# EAGLE schematic ESP32 EVSE (EAGLE 9.6.2)
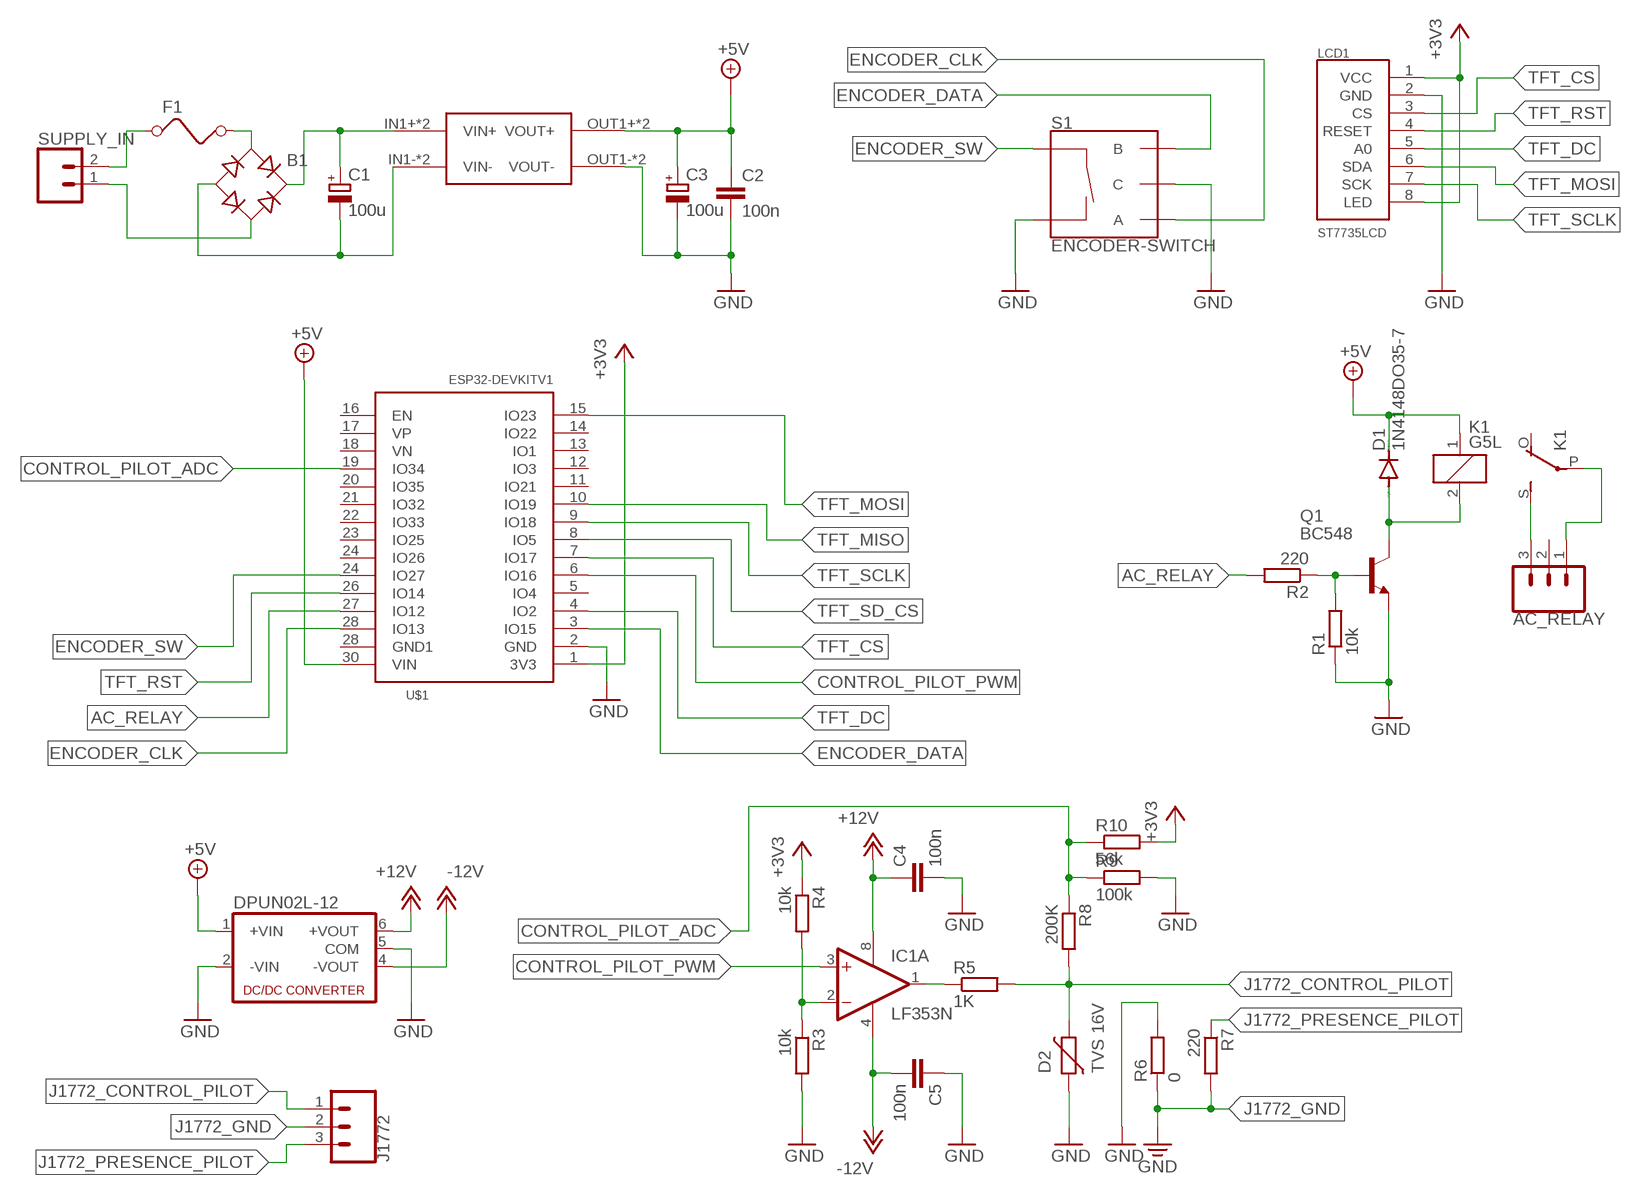
[diagram p0: schematic, sheet 1]

## Parts
AC_RELAY  CONN_03SCREW  [SCREWTERMINAL-3.5MM-3]
B1  B-DIL  [B-DIL]
C1  100u  CPOL-EUE2-5  [E2-5]
C2  100n  C-EU050-024X044  [C050-024X044]
C3  100u  CPOL-EUE2-5  [E2-5]
C4  100n  C-EU050-024X044  [C050-024X044]
C5  100n  C-EU050-024X044  [C050-024X044]
D1  1N4148DO35-7  [DO35-7]
D2  TVS 16V  TVS_DO-214AC(SMA)  [DIOM5226X290N]
DPUN02L-12  NMA  [NMA]
F1  FUSE  [FUSE]
IC1  LF353N  [DIL08]
J1772  CONN_03SCREW  [SCREWTERMINAL-3.5MM-3]
K1  G5L  [G5LE]
LCD1  ST7735LCD  [ST7735LCD]
Q1  BC548  [TO92-EBC]
R1  10k  R-EU_0204/5  [0204/5]
R2  220  R-EU_0204/5  [0204/5]
R3  10k  R-EU_0204/5  [0204/5]
R4  10k  R-EU_0204/5  [0204/5]
R5  1K  R-EU_0204/5  [0204/5]
R6  0  R-EU_0204/5  [0204/5]
R7  220  R-EU_0204/5  [0204/5]
R8  200K  R-EU_0204/5  [0204/5]
R9  100k  R-EU_0204/5  [0204/5]
R10  56k  R-EU_0204/5  [0204/5]
S1  ENCODER-SWITCH  [ROTARY_ENC_PLAIN]
SUPPLY_IN  CONN_023.5MM-NO_SILK  [SCREWTERMINAL-3.5MM-2-NS]
U$1  ESP32DEVKITV1  [ESP32-DEVKITV1]
U$2  MP1584  [DC-BRICK]

## Nets
+3V3: LCD1.1(VCC) LCD1.8(LED) R4.1 R10.2 U$1.1(3V3)
+5V: C2.1 C3.+ D1.C DPUN02L-12.1(+VIN) K1.1 U$1.30(VIN) U$2.OUT1+(VOUT+) U$2.OUT2+(VOUT+)
+12V: C4.1 DPUN02L-12.6(+VOUT) IC1.8(P:V+)
-12V: C5.2 DPUN02L-12.4(-VOUT) IC1.4(P:V-)
AC_RELAY: R2.2 U$1.27(IO12)
CONTROL_PILOT_ADC: R8.1 R9.1 R10.1 U$1.19(IO34)
CONTROL_PILOT_PWM: IC1.3(A:+IN) U$1.6(IO16)
ENCODER_CLK: S1.A U$1.28(IO13)
ENCODER_DATA: S1.B U$1.3(IO15)
ENCODER_SW: S1.SW+ U$1.24(IO27)
GND: C2.2 C3.- C4.2 C5.1 D2.1 DPUN02L-12.2(-VIN) DPUN02L-12.5(COM) LCD1.2(GND) Q1.E R1.1 R6.2 R9.2 S1.C S1.SW- U$1.2(GND) U$2.OUT1-(VOUT-) U$2.OUT2-(VOUT-)
J1772_CONTROL_PILOT: D2.2 J1772.1 R5.2 R8.2
J1772_GND: J1772.2 R6.1 R7.2 ; supply symbol labelled GND
J1772_PRESENCE_PILOT: J1772.3 R7.1
N$1: F1.1 SUPPLY_IN.2
N$2: B1.AC2 SUPPLY_IN.1
N$3: B1.AC1 F1.2
N$4: B1.- C1.- U$2.IN1-(VIN-) U$2.IN2-(VIN-)
N$5: B1.+ C1.+ U$2.IN1+(VIN+) U$2.IN2+(VIN+)
N$6: AC_RELAY.3 K1.S(2:S)
N$7: AC_RELAY.1 K1.P(2:P)
N$8: D1.A K1.2 Q1.C
N$9: Q1.B R1.2 R2.1
N$10: IC1.2(A:-IN) R3.1 R4.2
N$11: R3.2 ; supply symbol labelled GND
N$13: IC1.1(A:OUT) R5.1
TFT_CS: LCD1.3(CS) U$1.7(IO17)
TFT_DC: LCD1.5(A0) U$1.4(IO2)
TFT_MISO: U$1.10(IO19)
TFT_MOSI: LCD1.6(SDA) U$1.15(IO23)
TFT_RST: LCD1.4(RESET) U$1.26(IO14)
TFT_SCLK: LCD1.7(SCK) U$1.9(IO18)
TFT_SD_CS: U$1.8(IO5)
Unconnected: AC_RELAY.2 IC1.5(B:+IN) IC1.6(B:-IN) IC1.7(B:OUT) K1.O(2:O) U$1.5(IO4) U$1.11(IO21) U$1.12(IO3) U$1.13(IO1) U$1.14(IO22) U$1.16(EN) U$1.17(VP) U$1.18(VN) U$1.20(IO35) U$1.21(IO32) U$1.22(IO33) U$1.23(IO25) U$1.24(IO26) U$1.28(GND1)

## Library data of the parts
AC_RELAY J1772 = SparkFun-Connectors:CONN_03: Multi connection point. Often used as Generic Header-pin footprint for 0.1 inch spaced/style header connections On any of the 0.1 inch spaced packages, you can populate with these: Break Away Headers - Straight <https://www.sparkfun.com/products/116> (PRT-00116) Break Away Male Headers - Right Angle <https://www.sparkfun.com/products/553> (PRT-00553) Female Headers <https://www.sparkfun.com/products/115> (PRT-00115) Break Away Headers - Machine Pin <https://www.sparkfun.com/products/117> (PRT-00117) Break Away Female Headers - Swiss Machine Pin <https://www.sparkfun.com/products/743> (PRT-00743) Stackable Header - 3 Pin (Female, 0.1") <https://www.sparkfun.com/products/13875> (PRT-13875) For SCREWTERMINALS and SPRING TERMINALS visit here: Screw Terimnals on SparkFun.com <https://www.sparkfun.com/search/results?term=Screw+Terminals> (5mm/3.5mm/2.54mm spacing) This device is also useful as a general connection point to wire up your design to another part of your project. Our various solder wires solder well into these plated through hole pads. Hook-Up Wire - Assortment (Stranded, 22 AWG) <https://www.sparkfun.com/products/11375> (PRT-11375) Hook-Up Wire - Assortment (Solid Core, 22 AWG) <https://www.sparkfun.com/products/11367> (PRT-11367) View the entire wire category on our website here <https://www.sparkfun.com/categories/141> Special notes: Molex polarized connector foot print use with SKU : PRT-08232 with associated crimp pins and housings.; PROD_ID: CONN-08288; SF_ID: PRT-08235
B1 = rectifier:B-DIL: RECTIFIER
C1 C3 = rcl:CPOL-EU: POLARIZED CAPACITOR, European symbol; SPICEPREFIX: C
C2 C4 C5 = rcl:C-EU: CAPACITOR, European symbol; SPICEPREFIX: C
D1 = diode:1N4148: DIODE high speed (Philips)
D2 = Circuit-Protection:TVS: TVS Diode - Generic; CATEGORY: Circuit-Protection; SUB-CATEGORY: TVS-Diode
DPUN02L-12 = dc-dc-converter:NMA: DC-DC CONVERTER; MF: C & D TECHNOLOGIES, INC; MPN: NMA0515SC; OC_FARNELL: 1021434; OC_NEWARK: 61K3064
F1 = special:FUSE: FUSE 5 x 20 mm
IC1 = linear:LF353: OP AMP
K1 = relay:G5L: RELAY 1 x switch, 10 A/120 V AC, 8 A/30 V ADC, Omron; OC_FARNELL: unknown; OC_NEWARK: unknown
LCD1 = PulseOximeterECG_AU:ST7735LCD: Ebay Link <https://www.ebay.com/itm/1-44-Colorful-SPI-TFT-LCD-Display-ST7735-128X128-Replace-Nokia-5110-3310-LCD/192212322440?hash=item2cc0bf4888:g:Cy0AAOSwXXxZOmn-#rpdCntId>
Q1 = transistor-npn:BC548*: NPN Transistor
R1-R10 = resistor:R-EU_: RESISTOR, European symbol
S1 = SparkFun-Switches:ENCODER-SWITCH: Rotary Encoder w/ Select Switch Encoders rotate similarly to potentiometers, but they’re different from potentiometers in that an encoder has full rotation without limits. They output gray code so that you can tell how much and in which direction the encoder has been turned. This encoder includes a push-down select switch built into the shaft. SparkFun Products Rotary Encoder <https://www.sparkfun.com/products/9117> (COM-09117); SF_SKU: COM-09117
SUPPLY_IN = SparkFun-Connectors:CONN_02: Multi connection point. Often used as Generic Header-pin footprint for 0.1 inch spaced/style header connections On any of the 0.1 inch spaced packages, you can populate with these: Break Away Headers - Straight <https://www.sparkfun.com/products/116> (PRT-00116) Break Away Male Headers - Right Angle <https://www.sparkfun.com/products/553> (PRT-00553) Female Headers <https://www.sparkfun.com/products/115> (PRT-00115) Break Away Headers - Machine Pin <https://www.sparkfun.com/products/117> (PRT-00117) Break Away Female Headers - Swiss Machine Pin <https://www.sparkfun.com/products/743> (PRT-00743) For SCREWTERMINALS and SPRING TERMINALS visit here: Screw Terimnals on SparkFun.com <https://www.sparkfun.com/search/results?term=Screw+Terminals> (5mm/3.5mm/2.54mm spacing) This device is also useful as a general connection point to wire up your design to another part of your project. Our various solder wires solder well into these plated through hole pads. Hook-Up Wire - Assortment (Stranded, 22 AWG) <https://www.sparkfun.com/products/11375> (PRT-11375) Hook-Up Wire - Assortment (Solid Core, 22 AWG) <https://www.sparkfun.com/products/11367> (PRT-11367) View the entire wire category on our website here <https://www.sparkfun.com/categories/141> Special notes: Molex polarized connector foot print use with: PRT-08233 with associated crimp pins and housings. 2.54_SCREWTERM for use with PRT-10571. 3.5mm Screw Terminal footprints for PRT-08084 5mm Screw Terminal footprints for use with PRT-08432; PROD_ID: CONN-08399
U$1 = ESP32-DEVKITV1:ESP32DEVKITV1
U$2 = MP1584-dc-brick:MP1584: MP1584-dc-brick-pcb Step down Input: 4.5V - 28V Ouput 0.8V - 25V max. 3A Cheap on ebay